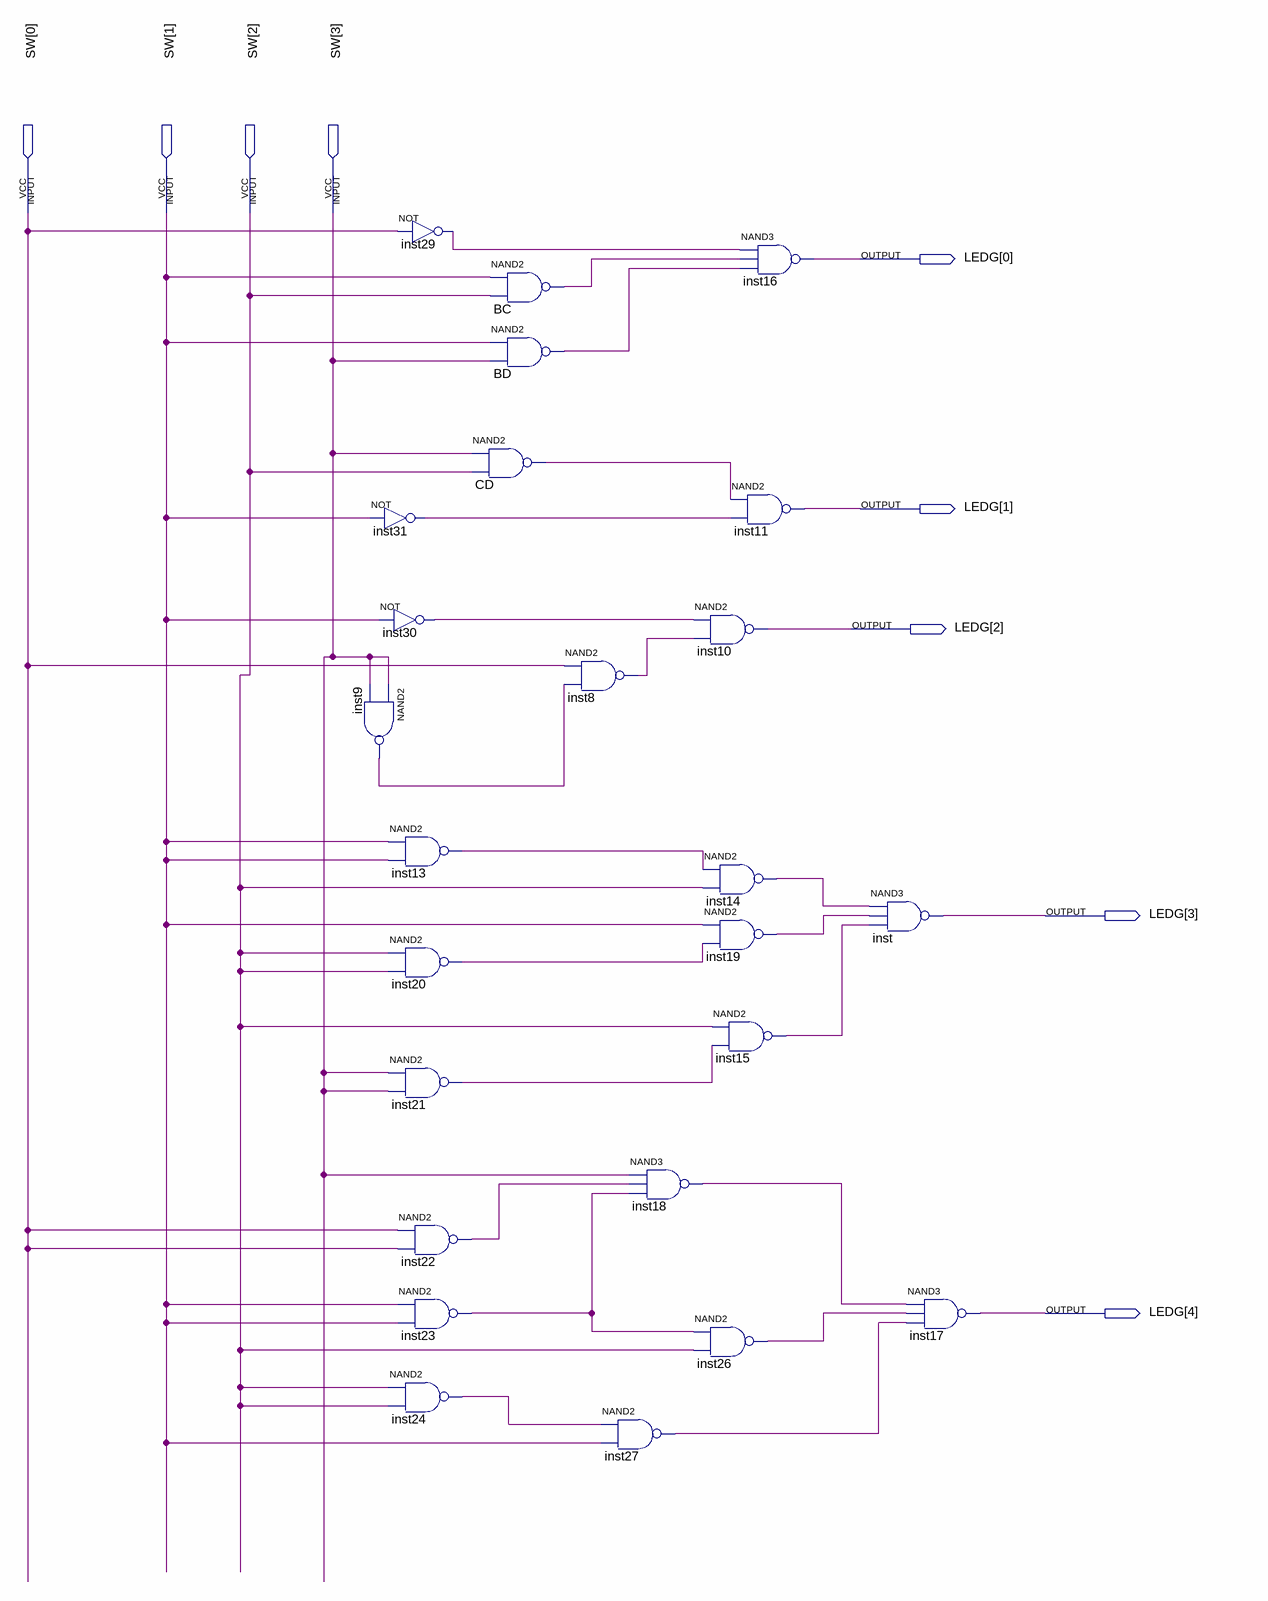
[diagram p0: schematic sheet]
// Quartus schematic lab5.bdf as structural Verilog: 25 symbols, 9 pins
module lab5 (
  input  [3:0] SW,
  output [4:0] LEDG
);

  wire BC_out, BD_out, CD_out, inst8_out, inst9_out, inst13_out, inst14_out, inst15_out, inst18_out,
       inst19_out, inst20_out, inst21_out, inst22_out, inst23_out, inst24_out, inst26_out, inst27_out,
       inst29_out, inst30_out, inst31_out;

  not inst29 (inst29_out, SW[0]);
  not inst31 (inst31_out, SW[1]);
  not inst30 (inst30_out, SW[1]);
  nand inst9 (inst9_out, SW[3], SW[3]);
  nand inst13 (inst13_out, SW[1], SW[1]);
  nand inst20 (inst20_out, SW[2], SW[2]);
  nand inst21 (inst21_out, SW[3], SW[3]);
  nand inst22 (inst22_out, SW[0], SW[0]);
  nand inst23 (inst23_out, SW[1], SW[1]);
  nand inst24 (inst24_out, SW[2], SW[2]);
  nand BC (BC_out, SW[1], SW[2]);
  nand BD (BD_out, SW[1], SW[3]);
  nand CD (CD_out, SW[3], SW[2]);
  nand inst8 (inst8_out, SW[0], inst9_out);
  nand inst18 (inst18_out, SW[3], inst22_out, inst23_out);
  nand inst27 (inst27_out, inst24_out, SW[1]);
  nand inst10 (LEDG[2], inst30_out, inst8_out);
  nand inst14 (inst14_out, inst13_out, SW[2]);
  nand inst19 (inst19_out, SW[1], inst20_out);
  nand inst15 (inst15_out, SW[2], inst21_out);
  nand inst26 (inst26_out, inst23_out, SW[2]);
  nand inst16 (LEDG[0], inst29_out, BC_out, BD_out);
  nand inst11 (LEDG[1], CD_out, inst31_out);
  nand inst (LEDG[3], inst14_out, inst19_out, inst15_out);
  nand inst17 (LEDG[4], inst18_out, inst26_out, inst27_out);
endmodule
